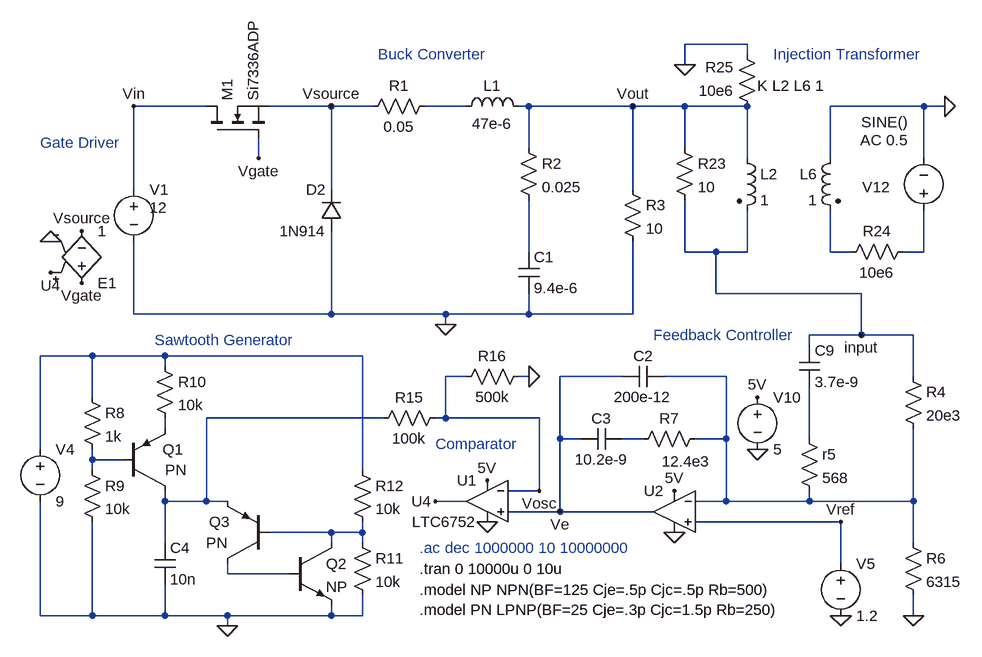
[diagram p0: schematic CompleteCircuit.asc]
CompleteCircuit.asc, the LTspice schematic file:
Version 4
SHEET 1 1140 680
WIRE -2736 -1584 -2832 -1584
WIRE -2736 -1568 -2736 -1584
WIRE -2832 -1552 -2832 -1584
WIRE -3568 -1488 -3680 -1488
WIRE -3376 -1488 -3472 -1488
WIRE -3312 -1488 -3376 -1488
WIRE -3168 -1488 -3232 -1488
WIRE -3072 -1488 -3088 -1488
WIRE -2912 -1488 -3072 -1488
WIRE -2832 -1488 -2912 -1488
WIRE -2736 -1488 -2832 -1488
WIRE -2464 -1488 -2608 -1488
WIRE -2432 -1488 -2464 -1488
WIRE -3072 -1424 -3072 -1488
WIRE -2832 -1424 -2832 -1488
WIRE -3488 -1408 -3488 -1440
WIRE -2736 -1408 -2736 -1488
WIRE -2608 -1408 -2608 -1488
WIRE -2464 -1408 -2464 -1488
WIRE -3680 -1360 -3680 -1488
WIRE -3376 -1360 -3376 -1488
WIRE -2912 -1360 -2912 -1488
WIRE -3072 -1264 -3072 -1344
WIRE -2832 -1264 -2832 -1344
WIRE -2784 -1264 -2832 -1264
WIRE -2736 -1264 -2736 -1328
WIRE -2736 -1264 -2784 -1264
WIRE -2608 -1264 -2608 -1328
WIRE -2576 -1264 -2608 -1264
WIRE -2464 -1264 -2464 -1328
WIRE -2464 -1264 -2496 -1264
WIRE -2784 -1200 -2784 -1264
WIRE -2560 -1200 -2784 -1200
WIRE -3680 -1168 -3680 -1280
WIRE -3376 -1168 -3376 -1296
WIRE -3376 -1168 -3680 -1168
WIRE -3200 -1168 -3376 -1168
WIRE -3072 -1168 -3072 -1200
WIRE -3072 -1168 -3200 -1168
WIRE -2912 -1168 -2912 -1280
WIRE -2912 -1168 -3072 -1168
WIRE -3200 -1152 -3200 -1168
WIRE -2560 -1136 -2560 -1200
WIRE -2560 -1136 -2640 -1136
WIRE -2480 -1136 -2560 -1136
WIRE -2640 -1120 -2640 -1136
WIRE -3744 -1104 -3824 -1104
WIRE -3632 -1104 -3744 -1104
WIRE -3328 -1104 -3632 -1104
WIRE -3632 -1088 -3632 -1104
WIRE -3168 -1072 -3200 -1072
WIRE -3072 -1072 -3088 -1072
WIRE -2928 -1072 -3024 -1072
WIRE -2768 -1072 -2864 -1072
WIRE -2480 -1072 -2480 -1136
WIRE -3744 -1040 -3744 -1104
WIRE -3296 -1008 -3568 -1008
WIRE -3200 -1008 -3200 -1072
WIRE -3200 -1008 -3216 -1008
WIRE -3056 -1008 -3200 -1008
WIRE -3632 -992 -3632 -1008
WIRE -3024 -976 -3024 -1072
WIRE -2992 -976 -3024 -976
WIRE -2896 -976 -2928 -976
WIRE -2768 -976 -2768 -1072
WIRE -2768 -976 -2816 -976
WIRE -2640 -976 -2640 -1056
WIRE -3824 -960 -3824 -1104
WIRE -3744 -944 -3744 -960
WIRE -3696 -944 -3744 -944
WIRE -3744 -928 -3744 -944
WIRE -3328 -928 -3328 -1104
WIRE -3056 -896 -3056 -1008
WIRE -3056 -896 -3104 -896
WIRE -3632 -880 -3632 -896
WIRE -3568 -880 -3568 -1008
WIRE -3568 -880 -3632 -880
WIRE -3536 -880 -3568 -880
WIRE -3168 -880 -3216 -880
WIRE -2768 -880 -2768 -976
WIRE -2768 -880 -2816 -880
WIRE -2640 -880 -2640 -896
WIRE -2640 -880 -2768 -880
WIRE -2480 -880 -2480 -992
WIRE -2480 -880 -2640 -880
WIRE -3024 -864 -3024 -976
WIRE -3024 -864 -3104 -864
WIRE -2880 -864 -3024 -864
WIRE -2592 -848 -2816 -848
WIRE -3376 -832 -3472 -832
WIRE -3328 -832 -3328 -848
WIRE -3328 -832 -3376 -832
WIRE -3632 -816 -3632 -880
WIRE -3376 -816 -3376 -832
WIRE -3328 -816 -3328 -832
WIRE -2480 -816 -2480 -880
WIRE -2592 -784 -2592 -848
WIRE -3536 -768 -3536 -784
WIRE -3440 -768 -3536 -768
WIRE -3824 -704 -3824 -880
WIRE -3744 -704 -3744 -848
WIRE -3744 -704 -3824 -704
WIRE -3632 -704 -3632 -752
WIRE -3632 -704 -3744 -704
WIRE -3536 -704 -3632 -704
WIRE -3376 -704 -3376 -720
WIRE -3376 -704 -3536 -704
WIRE -3328 -704 -3328 -736
WIRE -3328 -704 -3376 -704
WIRE -2480 -704 -2480 -736
WIRE -3536 -688 -3536 -704
FLAG -2480 -704 0
FLAG -2912 -1488 Vout
FLAG -3024 -864 Ve
FLAG -2592 -848 Vref
FLAG -3680 -1488 Vin
FLAG -3056 -896 Vosc
FLAG -3760 -1216 Vgate
FLAG -3488 -1408 Vgate
FLAG -3760 -1296 Vsource
FLAG -3376 -1488 Vsource
FLAG -3808 -1232 U4
FLAG -3216 -880 U4
FLAG -2720 -960 0
FLAG -2720 -1040 5V
FLAG -3136 -912 5V
FLAG -2848 -896 5V
FLAG -3200 -1152 0
FLAG -2560 -1136 input
FLAG -2832 -1552 0
FLAG -2432 -1488 0
FLAG -3136 -848 0
FLAG -2848 -832 0
FLAG -3536 -688 0
FLAG -2592 -704 0
FLAG -3808 -1280 0
FLAG -3072 -1072 0
SYMBOL voltage -3824 -976 R0
WINDOW 123 0 0 Left 0
WINDOW 39 0 0 Left 0
SYMATTR InstName V4
SYMATTR Value 9
SYMBOL res -3760 -1056 R0
SYMATTR InstName R8
SYMATTR Value 1k
SYMBOL res -3760 -944 R0
SYMATTR InstName R9
SYMATTR Value 10k
SYMBOL res -3648 -1104 R0
SYMATTR InstName R10
SYMATTR Value 10k
SYMBOL cap -3648 -816 R0
SYMATTR InstName C4
SYMATTR Value 10n
SYMBOL pnp -3696 -896 M180
WINDOW 0 60 64 Left 2
WINDOW 3 64 32 Left 2
SYMATTR InstName Q1
SYMATTR Value PN
SYMBOL npn -3440 -816 R0
SYMATTR InstName Q2
SYMATTR Value NP
SYMBOL pnp -3472 -784 R180
WINDOW 0 60 64 Left 2
WINDOW 3 64 32 Left 2
SYMATTR InstName Q3
SYMATTR Value PN
SYMBOL res -3344 -832 R0
SYMATTR InstName R11
SYMATTR Value 10k
SYMBOL res -3344 -944 R0
SYMATTR InstName R12
SYMATTR Value 10k
SYMBOL ind -3184 -1472 R270
WINDOW 0 32 56 VTop 2
WINDOW 3 5 56 VBottom 2
SYMATTR InstName L1
SYMATTR Value 47e-6
SYMBOL cap -3088 -1264 R0
SYMATTR InstName C1
SYMATTR Value 9.4e-6
SYMBOL cap -2864 -1088 R90
WINDOW 0 0 32 VBottom 2
WINDOW 3 32 32 VTop 2
SYMATTR InstName C2
SYMATTR Value 200e-12
SYMBOL cap -2992 -960 R270
WINDOW 0 32 32 VTop 2
WINDOW 3 0 32 VBottom 2
SYMATTR InstName C3
SYMATTR Value 10.2e-9
SYMBOL cap -2656 -1120 R0
SYMATTR InstName C9
SYMATTR Value 3.7e-9
SYMBOL res -3328 -1472 R270
WINDOW 0 32 56 VTop 2
WINDOW 3 0 56 VBottom 2
SYMATTR InstName R1
SYMATTR Value 0.05
SYMBOL res -3088 -1440 R0
SYMATTR InstName R2
SYMATTR Value 0.025
SYMBOL res -2928 -1376 R0
SYMATTR InstName R3
SYMATTR Value 10
SYMBOL res -2496 -1088 R0
SYMATTR InstName R4
SYMATTR Value 20e3
SYMBOL res -2656 -992 R0
SYMATTR InstName r5
SYMATTR Value 568
SYMBOL res -2496 -832 R0
SYMATTR InstName R6
SYMATTR Value 6315
SYMBOL res -2800 -992 R90
WINDOW 0 0 56 VBottom 2
WINDOW 3 35 30 VTop 2
SYMATTR InstName R7
SYMATTR Value 12.4e3
SYMBOL diode -3360 -1296 R180
WINDOW 0 24 64 Left 2
WINDOW 3 24 0 Left 2
SYMATTR InstName D2
SYMATTR Value 1N914
SYMBOL nmos -3568 -1440 R270
SYMATTR InstName M1
SYMATTR Value Si7336ADP
SYMBOL voltage -3680 -1376 R0
WINDOW 3 24 44 Left 2
WINDOW 123 24 72 Left 2
WINDOW 39 0 0 Left 0
SYMATTR Value 12
SYMATTR InstName V1
SYMBOL voltage -2592 -800 R0
WINDOW 123 0 0 Left 0
WINDOW 39 0 0 Left 0
SYMATTR InstName V5
SYMATTR Value 1.2
SYMBOL e -3760 -1200 M180
SYMATTR InstName E1
SYMATTR Value 1
SYMBOL voltage -2720 -1056 R0
SYMATTR InstName V10
SYMATTR Value 5
SYMBOL Comparators\\LTC6752 -3136 -944 M0
SYMATTR InstName U1
SYMBOL voltage -2464 -1312 R180
WINDOW 3 24 152 Left 2
WINDOW 123 24 124 Left 2
WINDOW 39 0 0 Left 0
WINDOW 0 52 52 Left 2
SYMATTR Value SINE()
SYMATTR Value2 AC 0.5
SYMATTR InstName V12
SYMBOL OpAmps\\UniversalOpAmp2 -2848 -864 M0
SYMATTR InstName U2
SYMBOL ind2 -2752 -1424 R0
SYMATTR InstName L2
SYMATTR Type ind
SYMATTR Value 1
SYMBOL ind2 -2592 -1424 M0
SYMATTR InstName L6
SYMATTR Type ind
SYMATTR Value 1
SYMBOL res -2848 -1440 R0
SYMATTR InstName R23
SYMATTR Value 10
SYMBOL res -2480 -1280 R90
WINDOW 0 0 56 VBottom 2
WINDOW 3 32 56 VTop 2
SYMATTR InstName R24
SYMATTR Value 10e6
SYMBOL res -2720 -1472 R180
WINDOW 0 36 76 Left 2
WINDOW 3 36 40 Left 2
SYMATTR InstName R25
SYMATTR Value 10e6
SYMBOL res -3312 -992 R270
WINDOW 0 32 56 VTop 2
WINDOW 3 0 56 VBottom 2
SYMATTR InstName R15
SYMATTR Value 100k
SYMBOL res -3184 -1056 R270
WINDOW 0 32 56 VTop 2
WINDOW 3 0 56 VBottom 2
SYMATTR InstName R16
SYMATTR Value 500k
TEXT -3240 -744 Left 2 !.model NP NPN(BF=125 Cje=.5p Cjc=.5p Rb=500)\n.model PN LPNP(BF=25 Cje=.3p Cjc=1.5p Rb=250)
TEXT -3240 -808 Left 2 ;.ac dec 1000000 10 10000000
TEXT -2720 -1520 Left 2 !K L2 L6 1
TEXT -3648 -1128 Left 2 ;Sawtooth Generator
TEXT -2880 -1136 Left 2 ;Feedback Controller
TEXT -3304 -1568 Left 2 ;Buck Converter
TEXT -2696 -1568 Left 2 ;Injection Transformer
TEXT -3240 -776 Left 2 !.tran 0 10000u 0 10u
TEXT -3824 -1432 Left 2 ;Gate Driver
TEXT -3216 -968 Left 2 ;Comparator

The netlist it stands for:
* CompleteCircuit.asc
V4 N005 0 9
R8 N005 N011 1k
R9 N011 0 10k
R10 N005 N008 10k
C4 N007 0 10n
Q1 N007 N011 N008 0 PN
Q2 N012 N013 0 0 NP
Q3 N013 N012 N007 0 PN
R11 N012 0 10k
R12 N005 N012 10k
L1 N001 Vout 47e-6
C1 N002 0 9.4e-6
C2 N006 Ve 200e-12
C3 Ve N009 10.2e-9
C9 input N010 3.7e-9
R1 Vsource N001 0.05
R2 Vout N002 0.025
R3 Vout 0 10
R4 input N006 20e3
r5 N010 N006 568
R6 N006 0 6315
R7 N006 N009 12.4e3
D2 0 Vsource 1N914
M1 Vin Vgate Vsource Vsource Si7336ADP
V1 Vin 0 12
V5 Vref 0 1.2
E1 Vgate Vsource U4 0 1
V10 5V 0 5
XU1 Ve Vosc 5V 0 U4 LTC6752  ; pins In+ In- V+ V- OUT
V12 N004 0 SINE() AC 0.5
XU2 Vref N006 5V 0 Ve level2 Avol=1Meg GBW=10Meg Slew=10Meg Ilimit=25m Rail=0 Vos=0 En=0 Enk=0 In=0 Ink=0 Rin=500Meg  ; pins In+ In- V+ V- OUT
L2 Vout input 1
L6 0 N003 1
R23 Vout input 10
R24 N004 N003 10e6
R25 Vout 0 10e6
R15 N007 Vosc 100k
R16 Vosc 0 500k
.model D D
.lib standard.dio
.model NPN NPN
.model PNP PNP
.lib standard.bjt
.model NMOS NMOS
.model PMOS PMOS
.lib standard.mos
.model NP NPN(BF=125 Cje=.5p Cjc=.5p Rb=500)
.model PN LPNP(BF=25 Cje=.3p Cjc=1.5p Rb=250)
* .ac dec 1000000 10 10000000
K L2 L6 1
* Sawtooth Generator
* Feedback Controller
* Buck Converter
* Injection Transformer
.tran 0 10000u 0 10u
* Gate Driver
* Comparator
.lib LTC7.lib
.lib UniversalOpAmp2.lib
.backanno
.end